# Altium schematic sheet Kit_Evaluation_SunGoldPower.SchDoc
size A4
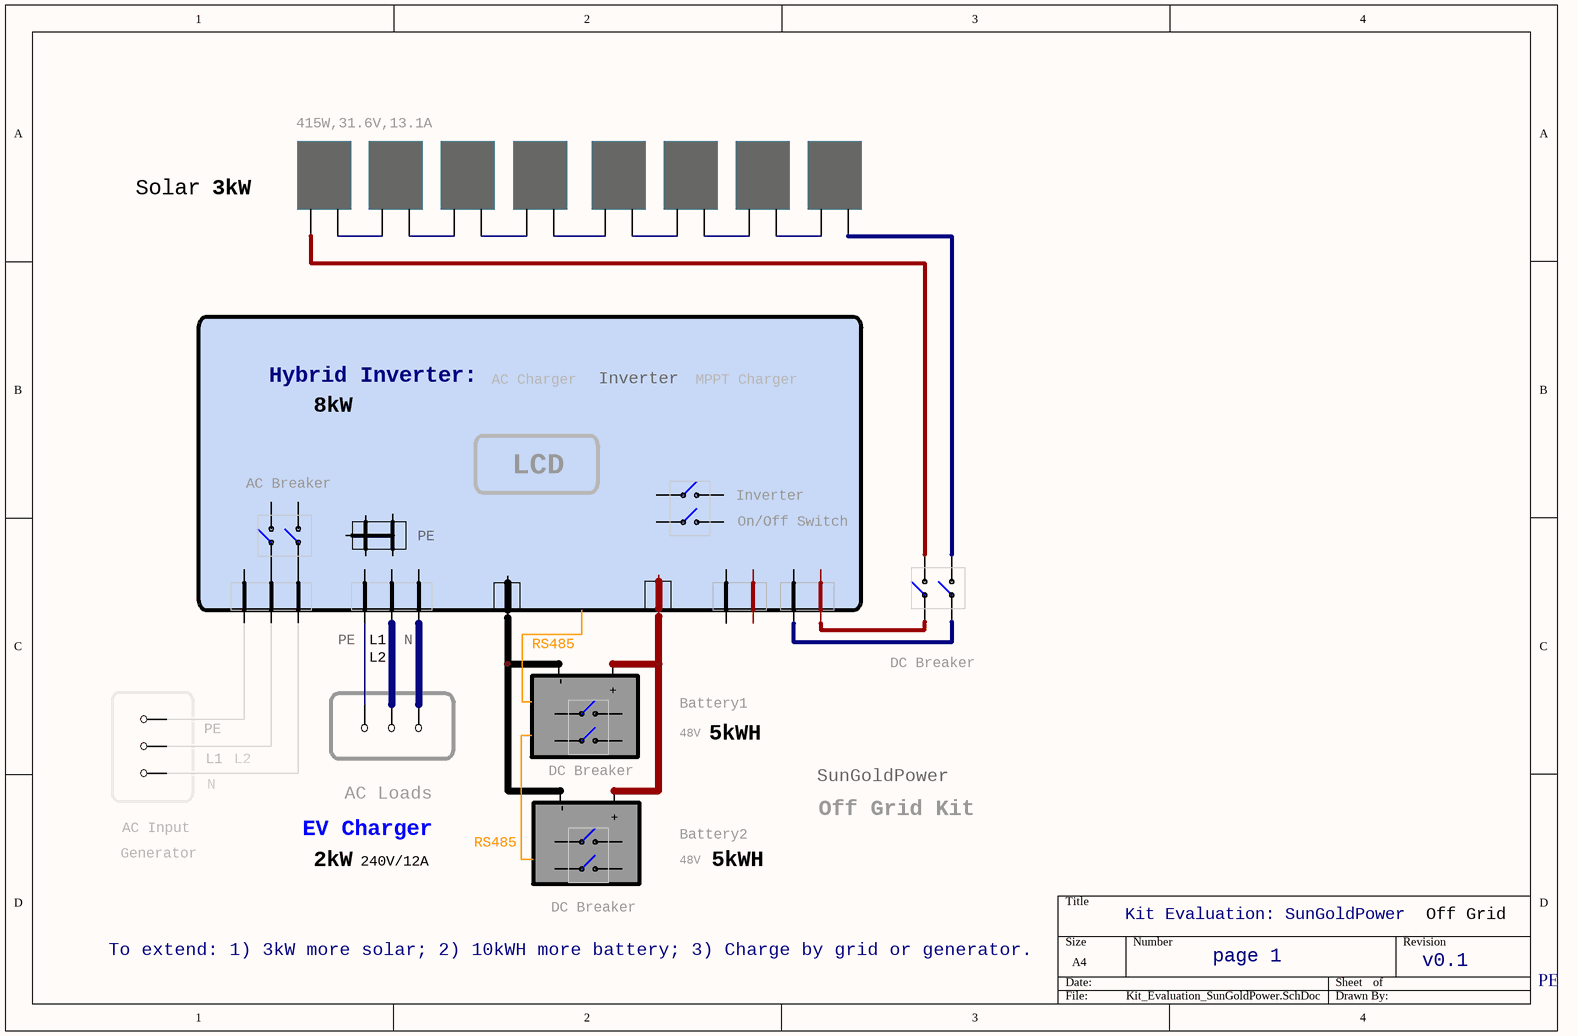
[diagram p0: Kit_Evaluation_SunGoldPower.SchDoc]

## Parts
(Parts that share a designator on the sheet are numbered #1, #2 ... from top to bottom, then left to right.)
B1022  3_Bus_Bar_Black  (value not drawn)
B1293  3_Bus_Bar_Red  (value not drawn)
Battery1022  48V Battery  (value not drawn)
Battery?  48V Battery  (value not drawn)
JP1102  3 HEADER  (value not drawn)
JP1203  3 HEADER  (value not drawn)
K003  3_Switch_2_box_narrow  (value not drawn)
K?#1  3_Switch_2_box_narrow  (value not drawn)
K?#2  3_Switch_2_box_narrow  (value not drawn)
K?#3  3_Switch_2_box_narrow  (value not drawn)
K?#4  3_Switch_2_box_narrow  (value not drawn)
S1023  Solar Panel  (value not drawn)
S1029  Solar Panel  (value not drawn)
S1234  Solar Panel  (value not drawn)
S1704  Solar Panel  (value not drawn)
S1902  Solar Panel  (value not drawn)
S1912  Solar Panel  (value not drawn)
S1923  Solar Panel  (value not drawn)
S1945  Solar Panel  (value not drawn)
T028  3_Bus_Bar_PE  (value not drawn)
T1234  4_Terminal_2_Red_Black  (value not drawn)
T1238  4_Terminal_2_Red_Black  (value not drawn)
U1297  4_Terminal_3  (value not drawn)
U2391  4_Terminal_3  (value not drawn)

## Blocks framed on the sheet
LCD: B1022 B1293 K?#1 K?#2 T028 T1234 T1238 U1297 U2391

## Nets
NetB1022_6: B1022.6 Battery1022.1(-) Battery?.1(-)
NetB1293_6: B1293.6 Battery1022.2(+) Battery?.2(+)
NetJP1102_1: JP1102.1 U2391.2
NetJP1102_2: JP1102.2 U2391.2
NetJP1102_3: JP1102.3 U2391.2
NetJP1203_1: JP1203.1 U1297.2
NetJP1203_2: JP1203.2 U1297.2
NetJP1203_3: JP1203.3 U1297.2
NetK003_1: K003.1 S1023.2(36V)
NetK003_2: K003.2 S1704.1(-)
NetK003_3: K003.3 T1238.1
NetK003_4: K003.4 T1238.1
NetK?#2_3: K?#2.3 U2391.1
NetK?#2_4: K?#2.4 U2391.1
NetS1023_1: S1023.1(-) S1029.2(36V)
NetS1029_1: S1029.1(-) S1234.2(36V)
NetS1234_1: S1234.1(-) S1912.2(36V)
NetS1704_2: S1704.2(36V) S1945.1(-)
NetS1902_1: S1902.1(-) S1923.2(36V)
NetS1902_2: S1902.2(36V) S1912.1(-)
NetS1923_1: S1923.1(-) S1945.2(36V)

Not connected (* = marked no-connect by the designer): B1022 1; B1293 1; K?#1 1 2 3 4; K?#2 1 2; K?#3 1 2 3 4; K?#4 1 2 3 4; T028 1 2 4 5 6; T1234 1 2; T1238 2; U1297 1

## Notes on the sheet
- 415W,31.6V,13.1A
- Solar
- 3kW
- Hybrid Inverter:
- AC Charger
- Inverter
- MPPT Charger
- 8kW
- AC Breaker
- (near K?#1) Inverter
- PE
- On/Off Switch
- (near U1297) PE
- (near U1297) L1
- (near U1297) N
- RS485
- L2
- Battery1
- DC Breaker
- L1
- N
- 48V
- 5kWH
- SunGoldPower
- (near JP1102) AC Input
- EV Charger
- (near JP1203) AC Loads
- Battery2
- Off Grid Kit
- Generator
- 2kW
- 240V/12A
- (near K?#4) DC Breaker
- Kit Evaluation: SunGoldPower
- Off Grid
- To extend: 1) 3kW more solar; 2) 10kWH more battery; 3) Charge by grid or generator.
- page 1
- v0.1

## Library data of the parts
Battery1022 Battery? = 1_BAT_48V
JP1102 JP1203 = 3 HEADER: 3 Pin Header
S1023 S1029 S1234 S1704 S1902 S1912 S1923 S1945 = 0_Solar_Panel_36V_narrow